# Altium schematic sheet powersupply_grid8_0.SchDoc: powersupply_grid8.sch
size 409 x 282 mm; Date: 12/19/2018 10:57:11 PM; SheetNumber: Sheet:
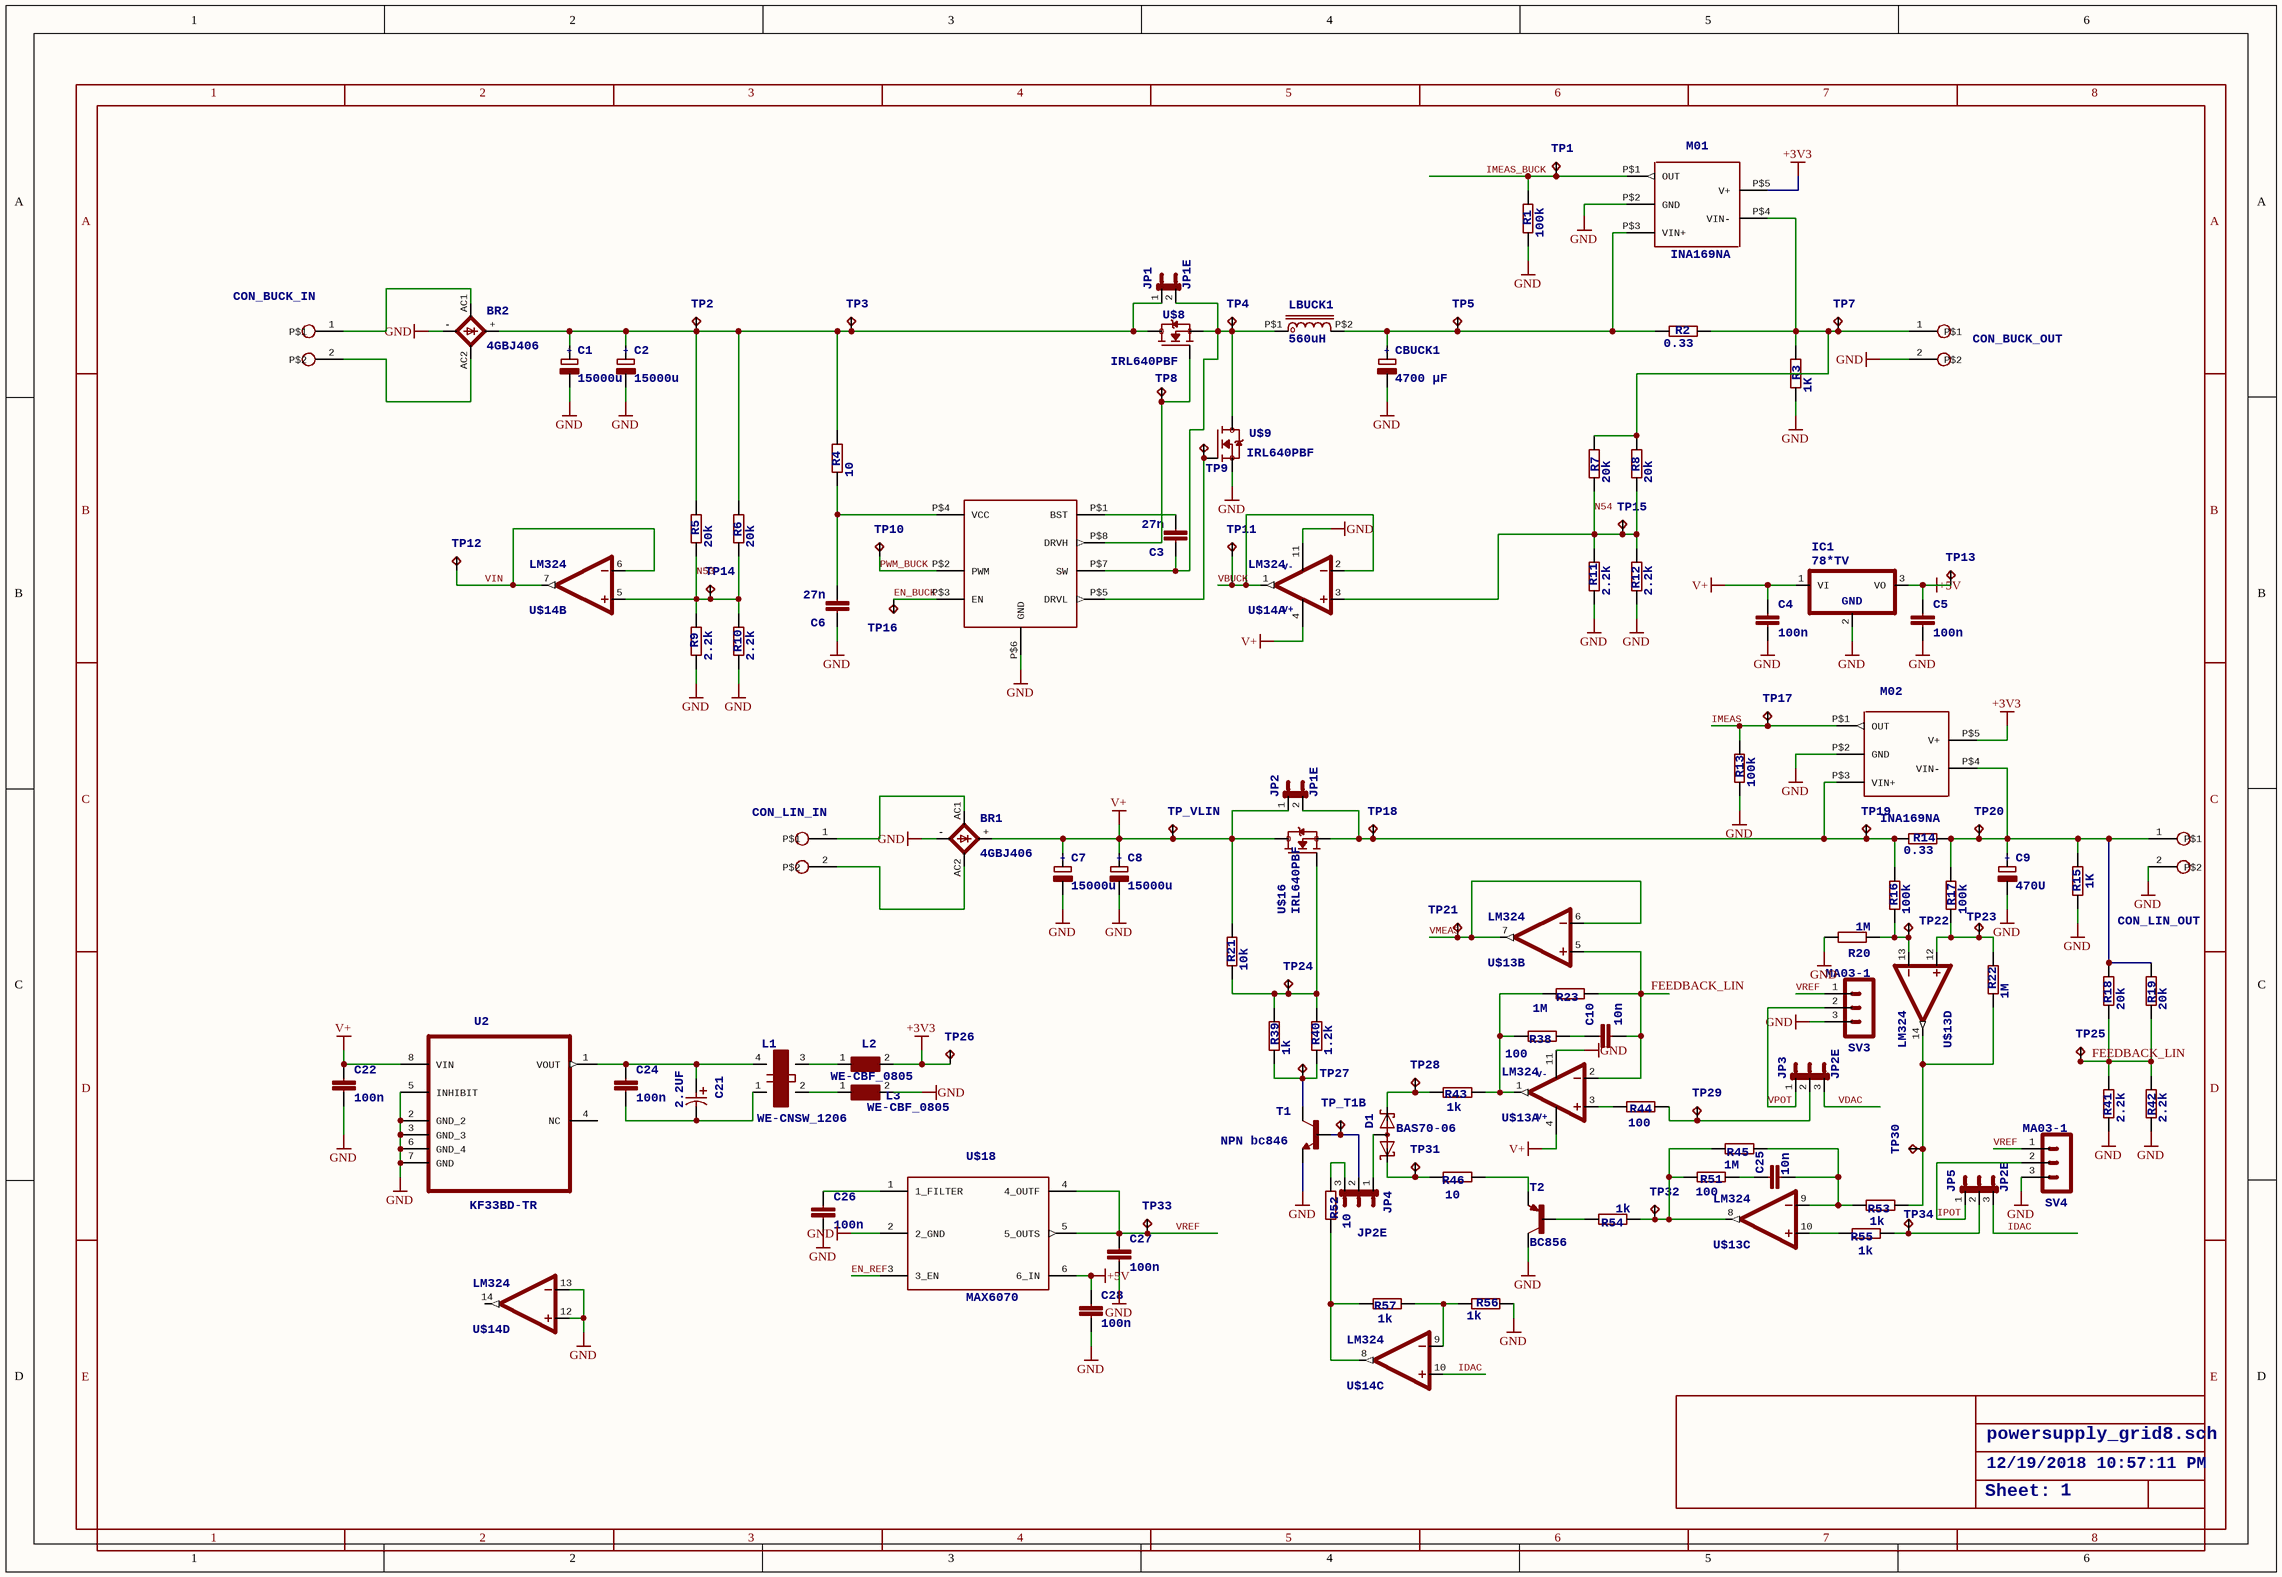
[diagram p0: powersupply_grid8_0.SchDoc]

## Parts
BR1  4GBJ406  [FB100]
BR2  4GBJ406  [FB100]
C1  15000u  [EB30D]
C2  15000u  [EB30D]
C3  27n  [C0805]
C4  100n  [C0402]
C5  100n  [C0402]
C6  27n  [C0805]
C7  15000u  [EB30D]
C8  15000u  [EB30D]
C9  470U  [E5-13]
C10  10n  [C0805]
C21  2.2UF  [CAPAE430X610N]
C22  100n  [C0603]
C24  100n  [C0603]
C25  10n  [C0805]
C26  100n  [C0402]
C27  100n  [C0402]
C28  100n  [C0402]
CBUCK1  4700 µF  [E7,5-18]
CON_BUCK_IN  POWERCON  [MKS1852-6-0-202]  (value not drawn)
CON_BUCK_OUT  POWERCON  [MKS1852-6-0-202]  (value not drawn)
CON_LIN_IN  POWERCON  [MKS1852-6-0-202]  (value not drawn)
CON_LIN_OUT  POWERCON  [MKS1852-6-0-202]  (value not drawn)
D1  BAS70-06  [SOT23]
IC1  78*TV  [TO220V]
JP1  JP1E  [JP1]
JP2  JP1E  [JP1]
JP3  JP2E  [JP2]
JP4  JP2E  [JP2]
JP5  JP2E  [JP2]
L1  WE-CNSW_1206  [WE-CNSW_1206]
L2  WE-CBF_0805  [0805]
L3  WE-CBF_0805  [0805]
LBUCK1  560uH  [PCV-2-564-08L]
M01  INA169NA  [SOT23]
M02  INA169NA  [SOT23]
R1  100k  [R0805]
R2  0.33  [R2010]
R3  1K  [R2512]
R4  10  [R0805]
R5  20k  [R0805]
R6  20k  [R0805]
R7  20k  [R0805]
R8  20k  [R0805]
R9  2.2k  [R0805]
R10  2.2k  [R0805]
R11  2.2k  [R0805]
R12  2.2k  [R0805]
R13  100k  [R0805]
R14  0.33  [R2010]
R15  1K  [R2512]
R16  100k  [R0805]
R17  100k  [R0805]
R18  20k  [R0805]
R19  20k  [R0805]
R20  1M  [R0805]
R21  10k  [R0805]
R22  1M  [R0805]
R23  1M  [R0805]
R38  100  [R0805]
R39  1k  [R0805]
R40  1.2k  [R0805]
R41  2.2k  [R0805]
R42  2.2k  [R0805]
R43  1k  [R0805]
R44  100  [R0805]
R45  1M  [R0805]
R46  10  [R0805]
R51  100  [R0805]
R52  10  [R0805]
R53  1k  [R0805]
R54  1k  [R0805]
R55  1k  [R0805]
R56  1k  [R0805]
R57  1k  [R0805]
SV3  MA03-1  [MA03-1]
SV4  MA03-1  [MA03-1]
T1  NPN bc846  [SOT23-BEC]
T2  BC856  [SOT23-BEC]
TP1  TPB2,54  [B2,54]  (value not drawn)
TP2  TPB2,54  [B2,54]  (value not drawn)
TP3  TPB2,54  [B2,54]  (value not drawn)
TP4  TPB2,54  [B2,54]  (value not drawn)
TP5  TPB2,54  [B2,54]  (value not drawn)
TP7  TPB2,54  [B2,54]  (value not drawn)
TP8  TPB2,54  [B2,54]  (value not drawn)
TP9  TPB2,54  [B2,54]  (value not drawn)
TP10  TPB2,54  [B2,54]  (value not drawn)
TP11  TPB2,54  [B2,54]  (value not drawn)
TP12  TPB2,54  [B2,54]  (value not drawn)
TP13  TPB2,54  [B2,54]  (value not drawn)
TP14  TPB2,54  [B2,54]  (value not drawn)
TP15  TPB2,54  [B2,54]  (value not drawn)
TP16  TPB2,54  [B2,54]  (value not drawn)
TP17  TPB2,54  [B2,54]  (value not drawn)
TP18  TPB2,54  [B2,54]  (value not drawn)
TP19  TPB2,54  [B2,54]  (value not drawn)
TP20  TPB2,54  [B2,54]  (value not drawn)
TP21  TPB2,54  [B2,54]  (value not drawn)
TP22  TPB2,54  [B2,54]  (value not drawn)
TP23  TPB2,54  [B2,54]  (value not drawn)
TP24  TPB2,54  [B2,54]  (value not drawn)
TP25  TPB2,54  [B2,54]  (value not drawn)
TP26  TPB2,54  [B2,54]  (value not drawn)
TP27  TPB2,54  [B2,54]  (value not drawn)
TP28  TPB2,54  [B2,54]  (value not drawn)
TP29  TPB2,54  [B2,54]  (value not drawn)
TP30  TPB2,54  [B2,54]  (value not drawn)
TP31  TPB2,54  [B2,54]  (value not drawn)
TP32  TPB2,54  [B2,54]  (value not drawn)
TP33  TPB2,54  [B2,54]  (value not drawn)
TP34  TPB2,54  [B2,54]  (value not drawn)
TP_T1B  TPB2,54  [B2,54]  (value not drawn)
TP_VLIN  TPB2,54  [B2,54]  (value not drawn)
U2  KF33BD-TR  [SOIC127P600X175-8N]
U$8  IRL640PBF  [TO-220AB]
U$9  IRL640PBF  [TO-220AB]
U$11  NCP5901B  [SOIC-8]  (value not drawn)
U$13  LM324  [SO14]  (parts A,B,C,D of 4)
U$14  LM324  [SO14]  (parts A,B,C,D of 4)
U$16  IRL640PBF  [TO-220AB]
U$18  MAX6070  [SOT23-6]

## Nets
+3V3: L2.2 M01.P$5(V+) M02.P$5(V+) TP26.TP
+5V: C5.1 C28.1 IC1.3(VO) TP13.TP U$18.6(6_IN)
GND: BR1.- BR2.- C1.- C2.- C4.2 C5.2 C6.1 C7.- C8.- C9.- C22.2 C26.2 C27.2 C28.2 CBUCK1.- CON_BUCK_OUT.2(P$2) CON_LIN_OUT.2(P$2) IC1.2(GND) L3.2 M01.P$2(GND) M02.P$2(GND) R1.1 R3.1 R9.1 R10.1 R11.1 R12.1 R13.1 R15.1 R20.2 R41.1 R42.1 R56.2 SV3.3 SV4.3 T1.E T2.C U2.2(GND_2) U2.3(GND_3) U2.5(INHIBIT) U2.6(GND_4) U2.7(GND) U$9.P$3(S) U$11.P$6(GND) U$13.11(V-) U$14.11(V-) U$14.12(+IN) U$14.13(-IN) U$18.2(2_GND)
V+: BR1.+ C4.1 C7.+ C8.+ C22.1 IC1.1(VI) JP2.1 R21.2 TP_VLIN.TP U2.8(VIN) U$13.4(V+) U$14.4(V+) U$16.P$2(D)
EN_BUCK: TP16.TP U$11.P$3(EN)
EN_REF: U$18.3(3_EN)
FEEDBACK_LIN: C10.2 R18.1 R19.1 R23.1 R41.2 R42.2 TP25.TP U$13.2(-IN) U$13.5(+IN)
IDAC: JP5.3 U$14.10(+IN)
IMEAS: M02.P$1(OUT) R13.2 TP17.TP
IMEAS_BUCK: M01.P$1(OUT) R1.2 TP1.TP
IPOT: JP5.1 SV4.2
N53: R5.1 R6.1 R9.2 R10.2 TP14.TP U$14.5(+IN)
N54: R7.1 R8.1 R11.2 R12.2 TP15.TP U$14.3(+IN)
PWM_BUCK: TP10.TP U$11.P$2(PWM)
VBUCK: TP11.TP U$14.1(OUT) U$14.2(-IN)
VDAC: JP3.3
VIN: TP12.TP U$14.6(-IN) U$14.7(OUT)
VMEAS: TP21.TP U$13.6(-IN) U$13.7(OUT)
VPOT: JP3.1 SV3.2
VREF: C27.1 SV3.1 SV4.1 TP33.TP U$18.4(4_OUTF) U$18.5(5_OUTS)
NetBR1_AC1: BR1.AC1 CON_LIN_IN.1(P$1)
NetBR1_AC2: BR1.AC2 CON_LIN_IN.2(P$2)
NetBR2_+: BR2.+ C1.+ C2.+ JP1.1 R4.2 R5.2 R6.2 TP2.TP TP3.TP U$8.P$2(D)
NetBR2_AC1: BR2.AC1 CON_BUCK_IN.1(P$1)
NetBR2_AC2: BR2.AC2 CON_BUCK_IN.2(P$2)
NetC3_1: C3.1 JP1.2 LBUCK1.P$1 TP4.TP U$8.P$3(S) U$9.P$2(D) U$11.P$7(SW)
NetC3_2: C3.2 U$11.P$1(BST)
NetC6_2: C6.2 R4.1 U$11.P$4(VCC)
NetC9_+: C9.+ CON_LIN_OUT.1(P$1) M02.P$4(VIN-) R14.2 R15.2 R17.2 R18.2 R19.2 TP20.TP
NetC10_1: C10.1 R38.1
NetC21_1: C21.1 C24.1 L1.4 U2.1(VOUT)
NetC21_2: C21.2 C24.2 L1.1
NetC25_1: C25.1 R51.1
NetC25_2: C25.2 R45.1 R53.2 U$13.9(-IN)
NetC26_1: C26.1 U$18.1(1_FILTER)
NetCBUCK1_+: CBUCK1.+ LBUCK1.P$2 M01.P$3(VIN+) R2.1 TP5.TP
NetCON_BUCK_OUT_1: CON_BUCK_OUT.1(P$1) M01.P$4(VIN-) R2.2 R3.2 R7.2 R8.2 TP7.TP
NetD1_1: D1.1(K1) R46.2 TP31.TP
NetD1_2: D1.2(K2) R43.2 TP28.TP
NetD1_3: D1.3(AA) JP4.1
NetJP2_2: JP2.2 M02.P$3(VIN+) R14.1 R16.2 TP18.TP TP19.TP U$16.P$3(S)
NetJP3_2: JP3.2 R44.1 TP29.TP
NetJP4_2: JP4.2 T1.B TP_T1B.TP
NetJP4_3: JP4.3 R52.1
NetJP5_2: JP5.2 R55.1 TP34.TP
NetL1_2: L1.2 L3.1
NetL1_3: L1.3 L2.1
NetR16_1: R16.1 R20.1 TP22.TP U$13.13(-IN)
NetR17_1: R17.1 R22.2 TP23.TP U$13.12(+IN)
NetR21_1: R21.1 R39.2 R40.2 TP24.TP U$16.P$1(G)
NetR22_1: R22.1 R53.1 TP30.TP U$13.14(OUT)
NetR23_2: R23.2 R38.2 R43.1 U$13.1(OUT)
NetR39_1: R39.1 R40.1 T1.C TP27.TP
NetR44_2: R44.2 U$13.3(+IN)
NetR45_2: R45.2 R51.2 R54.1 TP32.TP U$13.8(OUT)
NetR46_1: R46.1 T2.E
NetR52_2: R52.2 R57.2 U$14.8(OUT)
NetR54_2: R54.2 T2.B
NetR55_2: R55.2 U$13.10(+IN)
NetR56_1: R56.1 R57.1 U$14.9(-IN)
NetTP8_TP: TP8.TP U$8.P$1(G) U$11.P$8(DRVH)
NetTP9_TP: TP9.TP U$9.P$1(G) U$11.P$5(DRVL)

Not connected (* = marked no-connect by the designer): U2 4(NC); U$14 14(OUT)

## Notes on the sheet
- 1
- 2
- 3
- 4
- 5
- 6
- 7
- 8
- A
- B
- C
- D
- E

## Library data of the parts
C1 C2 C7 C8 = CPOL-EUE10-30: <B>POLARIZED CAPACITOR</B>, European symbol; +: +
C3 C6 C10 C25 = C-EUC0805: <B>CAPACITOR</B>, European symbol; SPICEPREFIX: C
C4 C5 C26-C28 = C-EUC0402: <B>CAPACITOR</B>, European symbol; SPICEPREFIX: C
C9 = CPOL-EUE5-13: <B>POLARIZED CAPACITOR</B>, European symbol; +: +
C21 = EEE--CASE-B: Aluminum Electrolytic Capacitors,Surface Mount Type; MPN: EEE-HC1HR47R; TOLERANCE: ±20 %; VALUE: 0.47UF; VOLTAGERATING: 50V; OC_FARNELL: 1714711; OC_NEWARK: 15R0920; PACKAGE: CASE-B; SUPPLIER: PANASONIC
C22 C24 = C-EUC0603: <B>CAPACITOR</B>, European symbol; SPICEPREFIX: C
CBUCK1 = B41888C7478M000: B41888C7478M000 -  Electrolytic Capacitor, 4700 µF, 35 V, B41888 Series, ± 20%, Radial Leaded, 18 mm; +: +
D1 = BAS70-06: <b>Silicon Schottky Diodes</b><p> / General-purpose diode for high-speed switching
IC1 = 78*TV: Positive <b>VOLTAGE REGULATOR</b><p> / Source:<br> / http://cache.national.com/ds/LM/LM78L05.pdf<br> / http://www.fairchildsemi.com/ds/LM/LM7805.pdf; GND: GND
JP1 JP2 = JP1E: <b>JUMPER</b>
JP3-JP5 = JP2E: <b>JUMPER</b>
L1 = WE-CNSW_1206: <b>SMD Common Mode Noise Suppressor WE-CNSW</b><p> / - High common mode suppression at high frequency<br> / - Small influence for high speed signals through winding symmetry<br><br> / -- USB 2.0<br> / -- Firewire / IEEE 1394 <br> / -- Power supply systems<br> / -- High Speed Data Lines<br> / -- Common mode data line filter; MPN: 744232601; OC_FARNELL: 1636477; OC_NEWARK: 08P2552; PACKAGE: 1206; SUPPLIER: WURTH ELEKTRONIK
L2 L3 = WE-CBF_0805: <b> SMD EMI Suppression Ferrite Beads WE-CBF</b> <p> / - Excellent anti-EMI properties <br> / - Low DC-restistance <br> / - Impedances till 3000 ohms <br> / - Rated current up to 6 A<p> / -- Reliable Ni-Sn electrodes<br> / -- Perfect as data lined filter and for uncoupling of distribution voltage<br>; MPN: 742792097; OC_FARNELL: 1635738; OC_NEWARK: 08P2386; PACKAGE: IND-0805; SUPPLIER: Wuerth Elektronik
LBUCK1 = PCV-2-564-08L
R1 R4-R13 R16-R23 R38-R46 R51-R57 = R-EU_R0805: <B>RESISTOR</B>, European symbol
R2 R14 = R-EU_R2010: <B>RESISTOR</B>, European symbol
R3 R15 = R-EU_R2512: <B>RESISTOR</B>, European symbol
SV3 SV4 = MA03-1: <b>PIN HEADER</b>; OC_FARNELL: unknown; OC_NEWARK: unknown
T1 = *-NPN-SOT23-BEC
T2 = *-PNP-SOT23-BEC: PNP Transistror
TP1-TP5 TP7-TP34 TP_T1B TP_VLIN = TPB2,54: <b>Test pad</b>
U2 = KF33BD-TR: LDO, 0.4VDO, 0.5A, 3.3V, 2%, 8SOIC; MPN: KF33BD-TR; OC_FARNELL: 2253497; OC_NEWARK: 25M9948; PACKAGE: SOIC-8; SUPPLIER: STMicroelectronics
U$11 = NCP5901B: The NCP5901B is a high performance dual MOSFET gate driver / optimized to drive the gates of both high−side and low−side power / MOSFETs in a synchronous buck converter.
U$13 U$14 = LM324: V+: V+; V-: V-